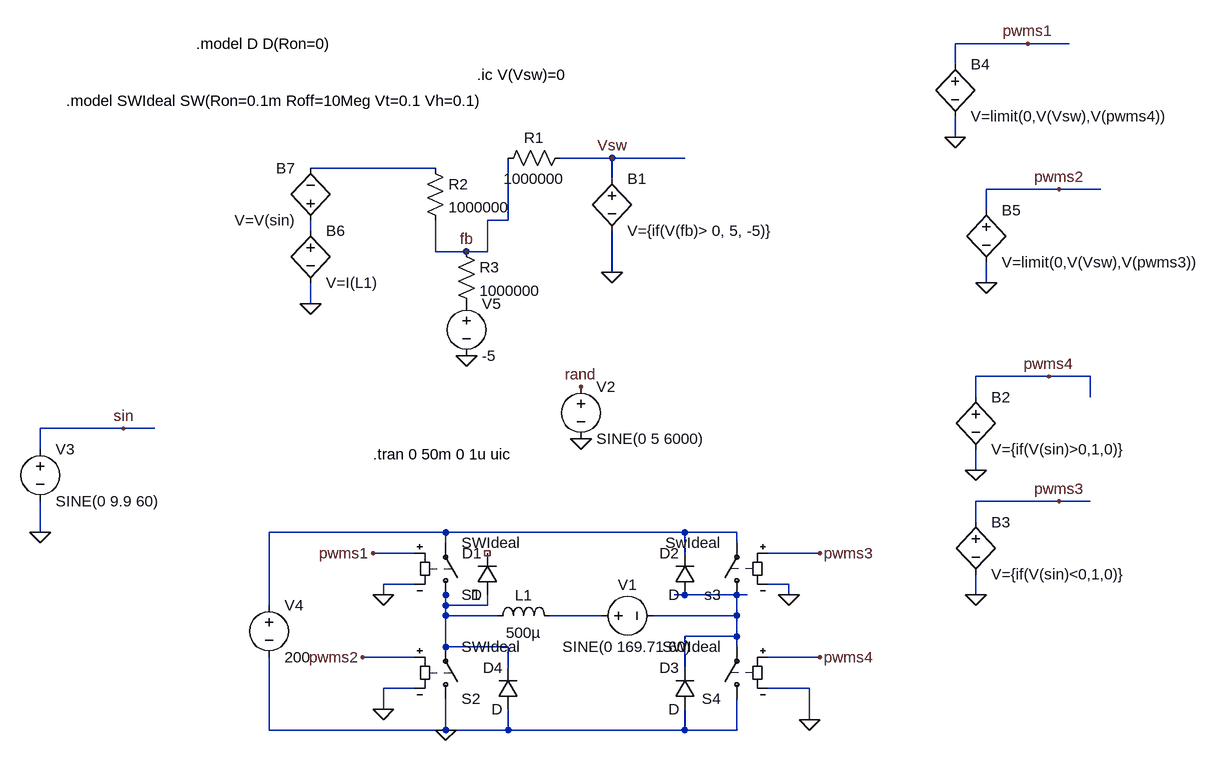
[diagram p0: schematic problem4_allabout.asc]
problem4_allabout.asc, the LTspice schematic file:
Version 4
SHEET 1 1332 1188
WIRE 1008 112 896 112
WIRE 1072 112 1008 112
WIRE 896 144 896 112
WIRE 896 256 896 224
WIRE 368 288 288 288
WIRE 480 288 368 288
WIRE 96 304 -96 304
WIRE 368 320 368 288
WIRE 1056 336 944 336
WIRE 1120 336 1056 336
WIRE 944 368 944 336
WIRE 208 384 208 288
WIRE 208 384 176 384
WIRE -96 400 -96 384
WIRE 96 432 96 384
WIRE 144 432 96 432
WIRE 176 432 176 384
WIRE 176 432 144 432
WIRE 368 464 368 400
WIRE 944 480 944 448
WIRE -96 512 -96 480
WIRE 1040 624 928 624
WIRE 1104 624 1040 624
WIRE 928 656 928 624
WIRE 1104 656 1104 624
WIRE -384 704 -512 704
WIRE -336 704 -384 704
WIRE -512 736 -512 704
WIRE 928 768 928 736
WIRE 1056 816 928 816
WIRE 1104 816 1056 816
WIRE 928 848 928 816
WIRE -512 864 -512 816
WIRE 112 864 -160 864
WIRE 480 864 112 864
WIRE 560 864 480 864
WIRE 112 880 112 864
WIRE 560 880 560 864
WIRE 64 896 0 896
WIRE 480 896 480 864
WIRE 688 896 608 896
WIRE 64 944 16 944
WIRE 640 944 608 944
WIRE 16 960 16 944
WIRE 112 960 112 944
WIRE 480 960 464 960
WIRE 560 960 480 960
WIRE 576 960 560 960
WIRE 640 960 640 944
WIRE 928 960 928 928
WIRE -160 976 -160 864
WIRE 112 976 112 960
WIRE 176 976 176 960
WIRE 176 976 112 976
WIRE 112 992 112 976
WIRE 192 992 112 992
WIRE 352 992 272 992
WIRE 560 992 560 960
WIRE 560 992 432 992
WIRE 560 1024 560 992
WIRE 560 1024 480 1024
WIRE 112 1040 112 992
WIRE 208 1040 112 1040
WIRE 560 1040 560 1024
WIRE 64 1056 -16 1056
WIRE 688 1056 608 1056
WIRE 208 1072 208 1040
WIRE 480 1072 480 1024
WIRE 64 1104 16 1104
WIRE 672 1104 608 1104
WIRE 16 1136 16 1104
WIRE 672 1152 672 1104
WIRE -160 1168 -160 1056
WIRE 112 1168 112 1120
WIRE 112 1168 -160 1168
WIRE 208 1168 208 1136
WIRE 208 1168 112 1168
WIRE 480 1168 480 1136
WIRE 480 1168 208 1168
WIRE 560 1168 560 1120
WIRE 560 1168 480 1168
FLAG 368 464 0
FLAG 144 432 fb
FLAG 320 720 0
FLAG 320 640 rand
FLAG 368 288 Vsw
FLAG -512 864 0
FLAG 0 896 pwms1
FLAG -16 1056 pwms2
FLAG 688 896 pwms3
FLAG 688 1056 pwms4
FLAG 16 960 0
FLAG 16 1136 0
FLAG 672 1152 0
FLAG 640 960 0
FLAG 928 768 0
FLAG 928 960 0
FLAG 1040 624 pwms4
FLAG 1056 816 pwms3
FLAG 896 256 0
FLAG 1008 112 pwms1
FLAG 944 480 0
FLAG 1056 336 pwms2
FLAG 112 1168 0
FLAG -384 704 sin
FLAG -96 512 0
FLAG 144 592 0
SYMBOL bv 368 304 R0
SYMATTR InstName B1
SYMATTR Value V={if(V(fb)> 0, 5, -5)}
SYMBOL res 304 272 R90
WINDOW 0 0 56 VBottom 2
WINDOW 3 32 56 VTop 2
SYMATTR InstName R1
SYMATTR Value 1000000
SYMBOL res 80 288 R0
SYMATTR InstName R2
SYMATTR Value 1000000
SYMBOL voltage 320 624 R0
WINDOW 123 0 0 Left 0
WINDOW 39 0 0 Left 0
SYMATTR InstName V2
SYMATTR Value SINE(0 5 6000)
SYMBOL ind 176 1008 R270
WINDOW 0 32 56 VTop 2
WINDOW 3 5 56 VBottom 2
SYMATTR InstName L1
SYMATTR Value 500µ
SYMBOL voltage 336 992 R270
WINDOW 0 32 56 VTop 2
WINDOW 3 -32 56 VBottom 2
WINDOW 123 0 0 Left 0
WINDOW 39 0 0 Left 0
SYMATTR InstName V1
SYMATTR Value SINE(0 169.71 60)
SYMBOL sw 112 976 M180
SYMATTR InstName S1
SYMATTR Value SWIdeal
SYMBOL sw 112 1136 M180
SYMATTR InstName S2
SYMATTR Value SWIdeal
SYMBOL sw 560 976 R180
SYMATTR InstName s3
SYMATTR Value SwIdeal
SYMBOL sw 560 1136 R180
SYMATTR InstName S4
SYMATTR Value SWIdeal
SYMBOL voltage -160 960 R0
WINDOW 123 0 0 Left 0
WINDOW 39 0 0 Left 0
SYMATTR InstName V4
SYMATTR Value 200
SYMBOL bv 928 640 R0
SYMATTR InstName B2
SYMATTR Value V={if(V(sin)>0,1,0)}
SYMBOL bv 928 832 R0
SYMATTR InstName B3
SYMATTR Value V={if(V(sin)<0,1,0)}
SYMBOL bv 896 128 R0
SYMATTR InstName B4
SYMATTR Value V=limit(0,V(Vsw),V(pwms4))
SYMBOL bv 944 352 R0
SYMATTR InstName B5
SYMATTR Value V=limit(0,V(Vsw),V(pwms3))
SYMBOL diode 192 960 R180
WINDOW 0 24 64 Left 2
WINDOW 3 24 0 Left 2
SYMATTR InstName D1
SYMBOL diode 496 960 R180
WINDOW 0 24 64 Left 2
WINDOW 3 24 0 Left 2
SYMATTR InstName D2
SYMBOL diode 496 1136 R180
WINDOW 0 24 64 Left 2
WINDOW 3 24 0 Left 2
SYMATTR InstName D3
SYMBOL diode 224 1136 R180
WINDOW 0 24 64 Left 2
WINDOW 3 24 0 Left 2
SYMATTR InstName D4
SYMBOL bv -96 384 R0
SYMATTR InstName B6
SYMATTR Value V=I(L1)
SYMBOL voltage -512 720 R0
WINDOW 123 0 0 Left 0
WINDOW 39 0 0 Left 0
SYMATTR InstName V3
SYMATTR Value SINE(0 9.9 60)
SYMBOL bv -96 400 R180
WINDOW 0 24 96 Left 2
WINDOW 3 24 16 Left 2
SYMATTR InstName B7
SYMATTR Value V=V(sin)
SYMBOL res 128 416 R0
SYMATTR InstName R3
SYMATTR Value 1000000
SYMBOL voltage 144 496 R0
WINDOW 123 0 0 Left 0
WINDOW 39 0 0 Left 0
SYMATTR InstName V5
SYMATTR Value -5
TEXT 0 744 Left 2 !.tran 0 50m 0 1u uic
TEXT 160 160 Left 2 !.ic V(Vsw)=0
TEXT -272 112 Left 2 !.model D D(Ron=0)
TEXT -472 200 Left 2 !.model SWIdeal SW(Ron=0.1m Roff=10Meg Vt=0.1 Vh=0.1)

The netlist it stands for:
* problem4_allabout.asc
B1 Vsw 0 V={if(V(fb)> 0, 5, -5)}
R1 Vsw fb 1000000
R2 N001 fb 1000000
V2 rand 0 SINE(0 5 6000)
L1 N004 N006 500µ
V1 N006 N005 SINE(0 169.71 60)
S1 N004 N003 pwms1 0 SWIdeal
S2 0 N004 pwms2 0 SWIdeal
s3 N005 N003 pwms3 0 SwIdeal
S4 0 N005 pwms4 0 SWIdeal
V4 N003 0 200
B2 pwms4 0 V={if(V(sin)>0,1,0)}
B3 pwms3 0 V={if(V(sin)<0,1,0)}
B4 pwms1 0 V=limit(0,V(Vsw),V(pwms4))
B5 pwms2 0 V=limit(0,V(Vsw),V(pwms3))
D1 N004 NC_01 D
D2 N005 N003 D
D3 0 N005 D
D4 0 N004 D
B6 N002 0 V=I(L1)
V3 sin 0 SINE(0 9.9 60)
B7 N002 N001 V=V(sin)
R3 fb P001 1000000
V5 P001 0 -5
.model D D
.lib standard.dio
.tran 0 50m 0 1u uic
.ic V(Vsw)=0
.model D D(Ron=0)
.model SWIdeal SW(Ron=0.1m Roff=10Meg Vt=0.1 Vh=0.1)
.backanno
.end

* Results of the author's LTspice run, read from the files saved beside the schematic
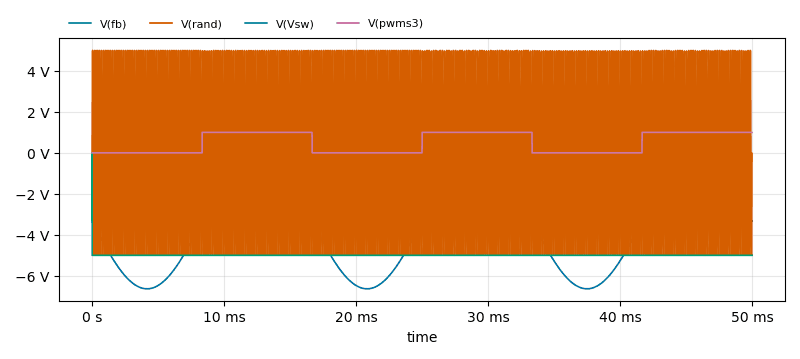
[diagram p1: Transient Analysis of problem4_allabout.asc, plotted from the saved traces]
* Transient Analysis, 1 run:
*   V(fb): min -6.633 V, max 0 V, average -3.333 V, rms 4.069 V, last -3.333 V
*   V(rand): min -5 V, max 5 V, average 544.1 nV, rms 3.535 V, last 0 V
*   V(Vsw): min -5 V, max 0 V, average -5 V, rms 5 V, last -5 V
*   V(pwms3): min 0 V, max 1 V, average 500 mV, rms 707.1 mV, last 1 V